# EasyEDA Pro project ax08.eprj, schematic ax08 lite, sheets 15 to 17 of 17

## Sheets
15 logic unit: Create Date: 2025-07-18; Page Name: logic unit; Update Date: 2025-08-11
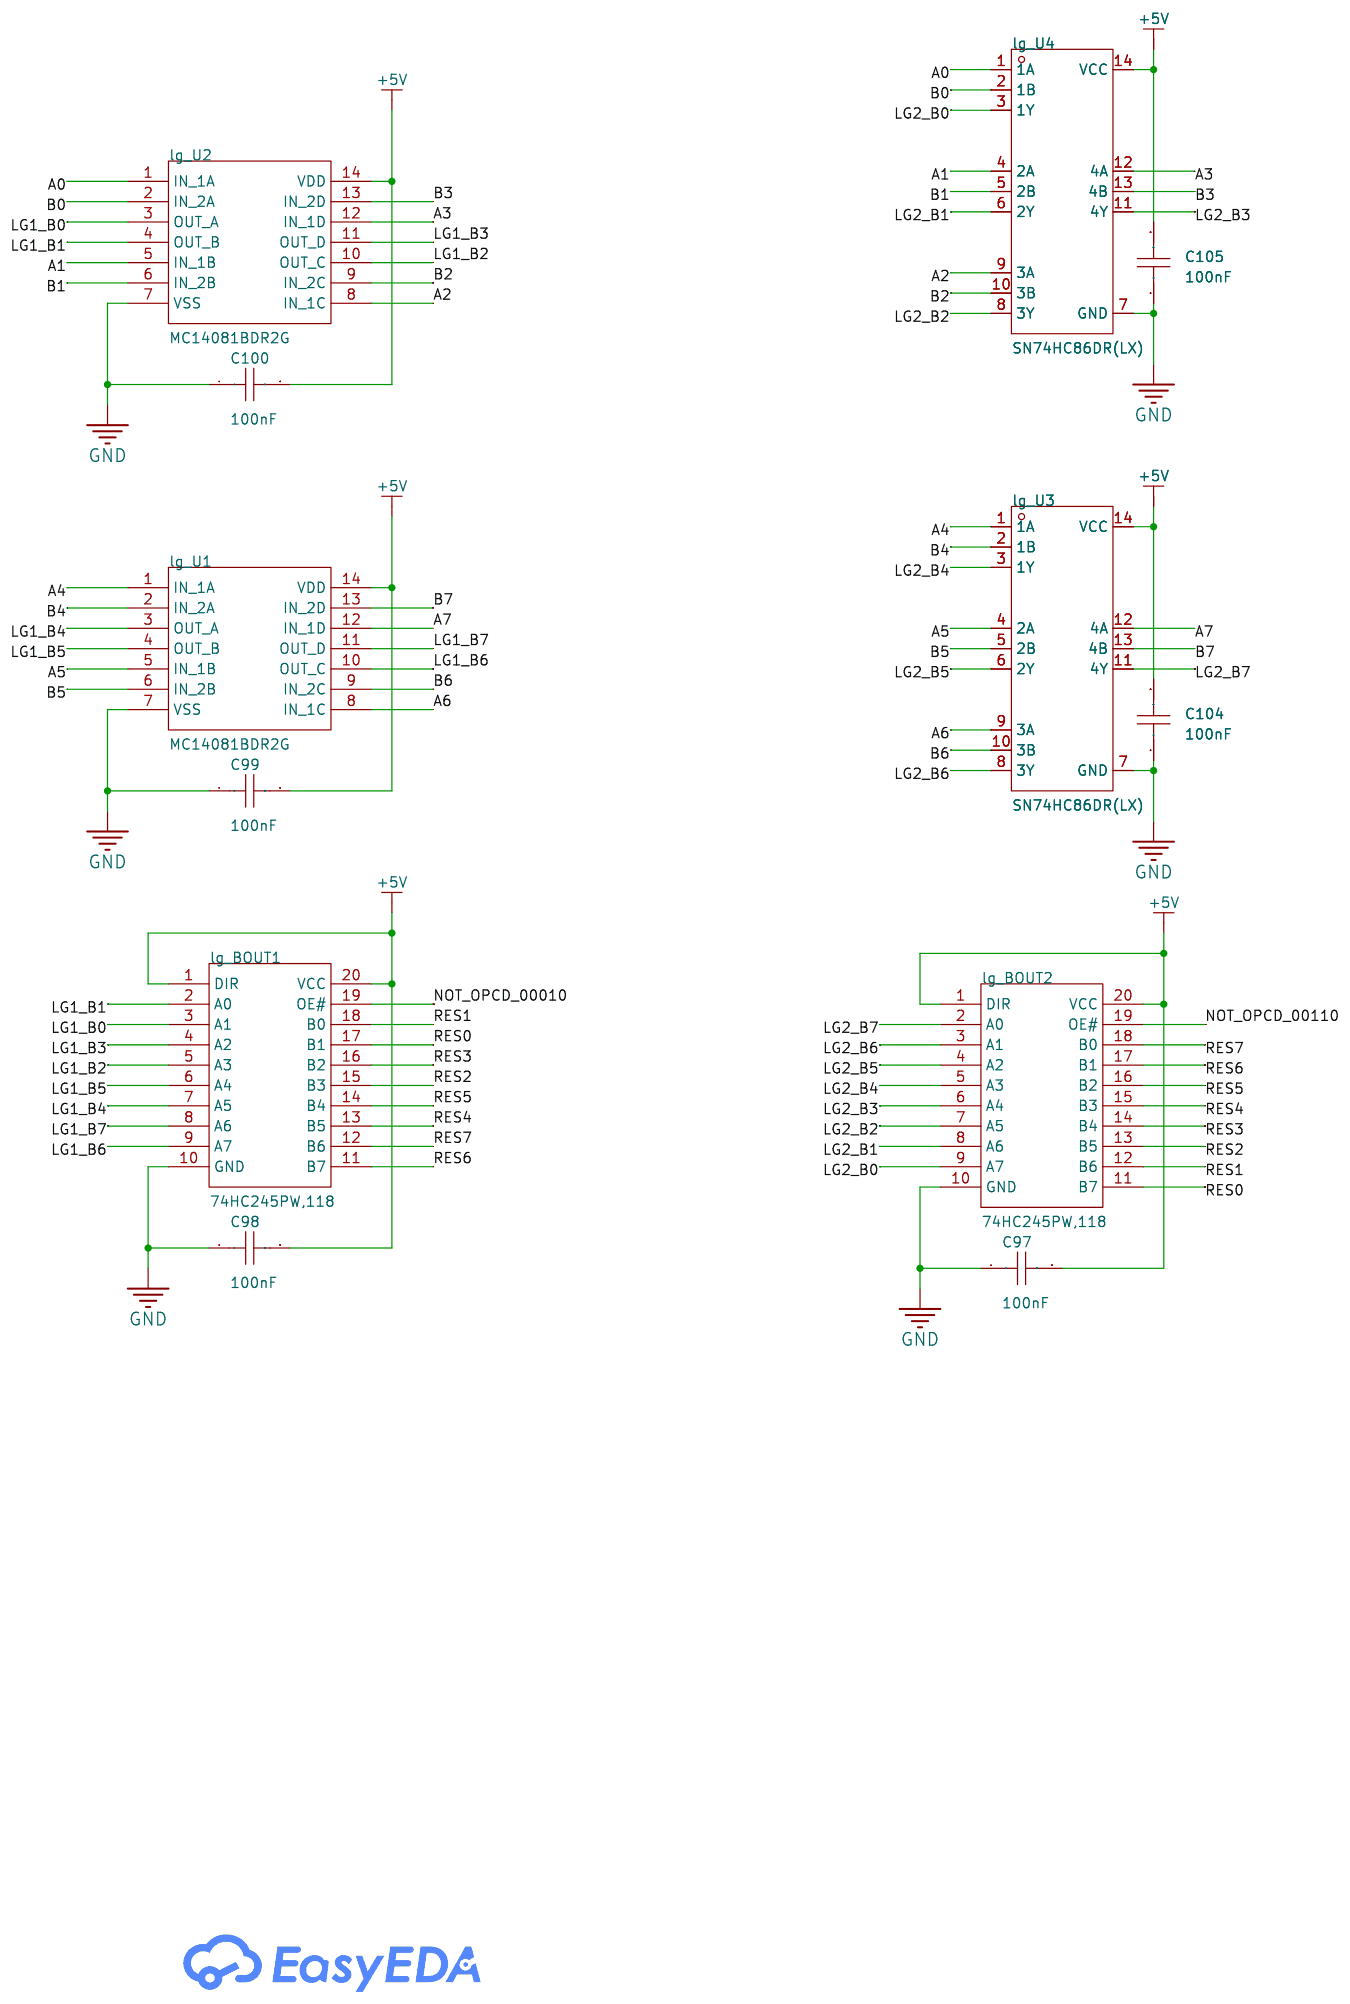
[diagram p16: logic unit]
16 power: Create Date: 2025-07-18; Page Name: power; Update Date: 2025-08-05
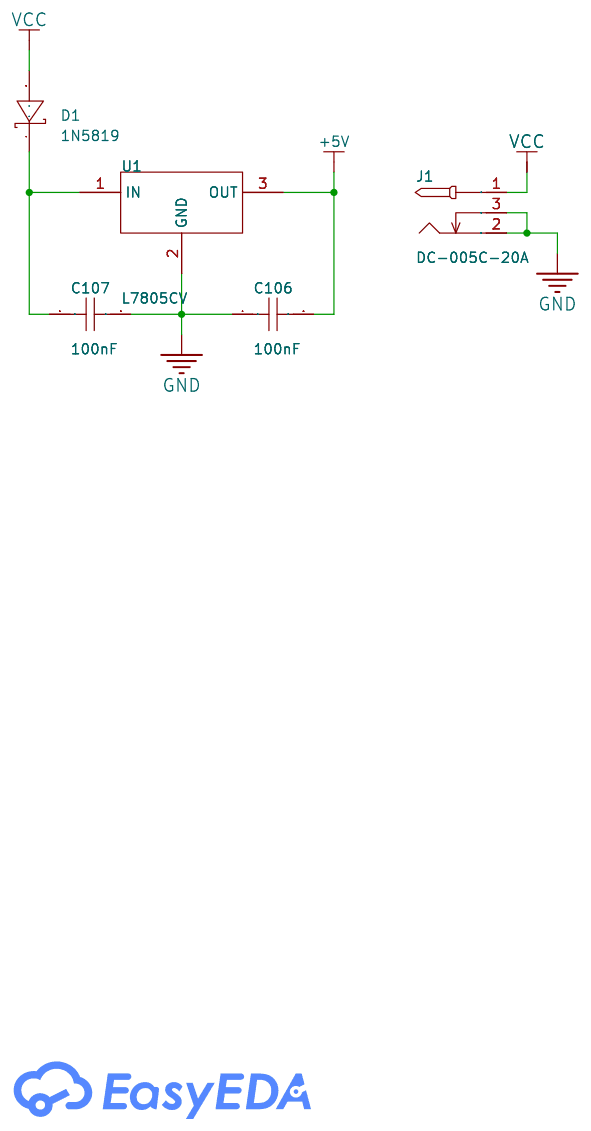
[diagram p17: power]
17 debug utils: Create Date: 2025-07-18; Page Name: debug utils; Update Date: 2025-08-12
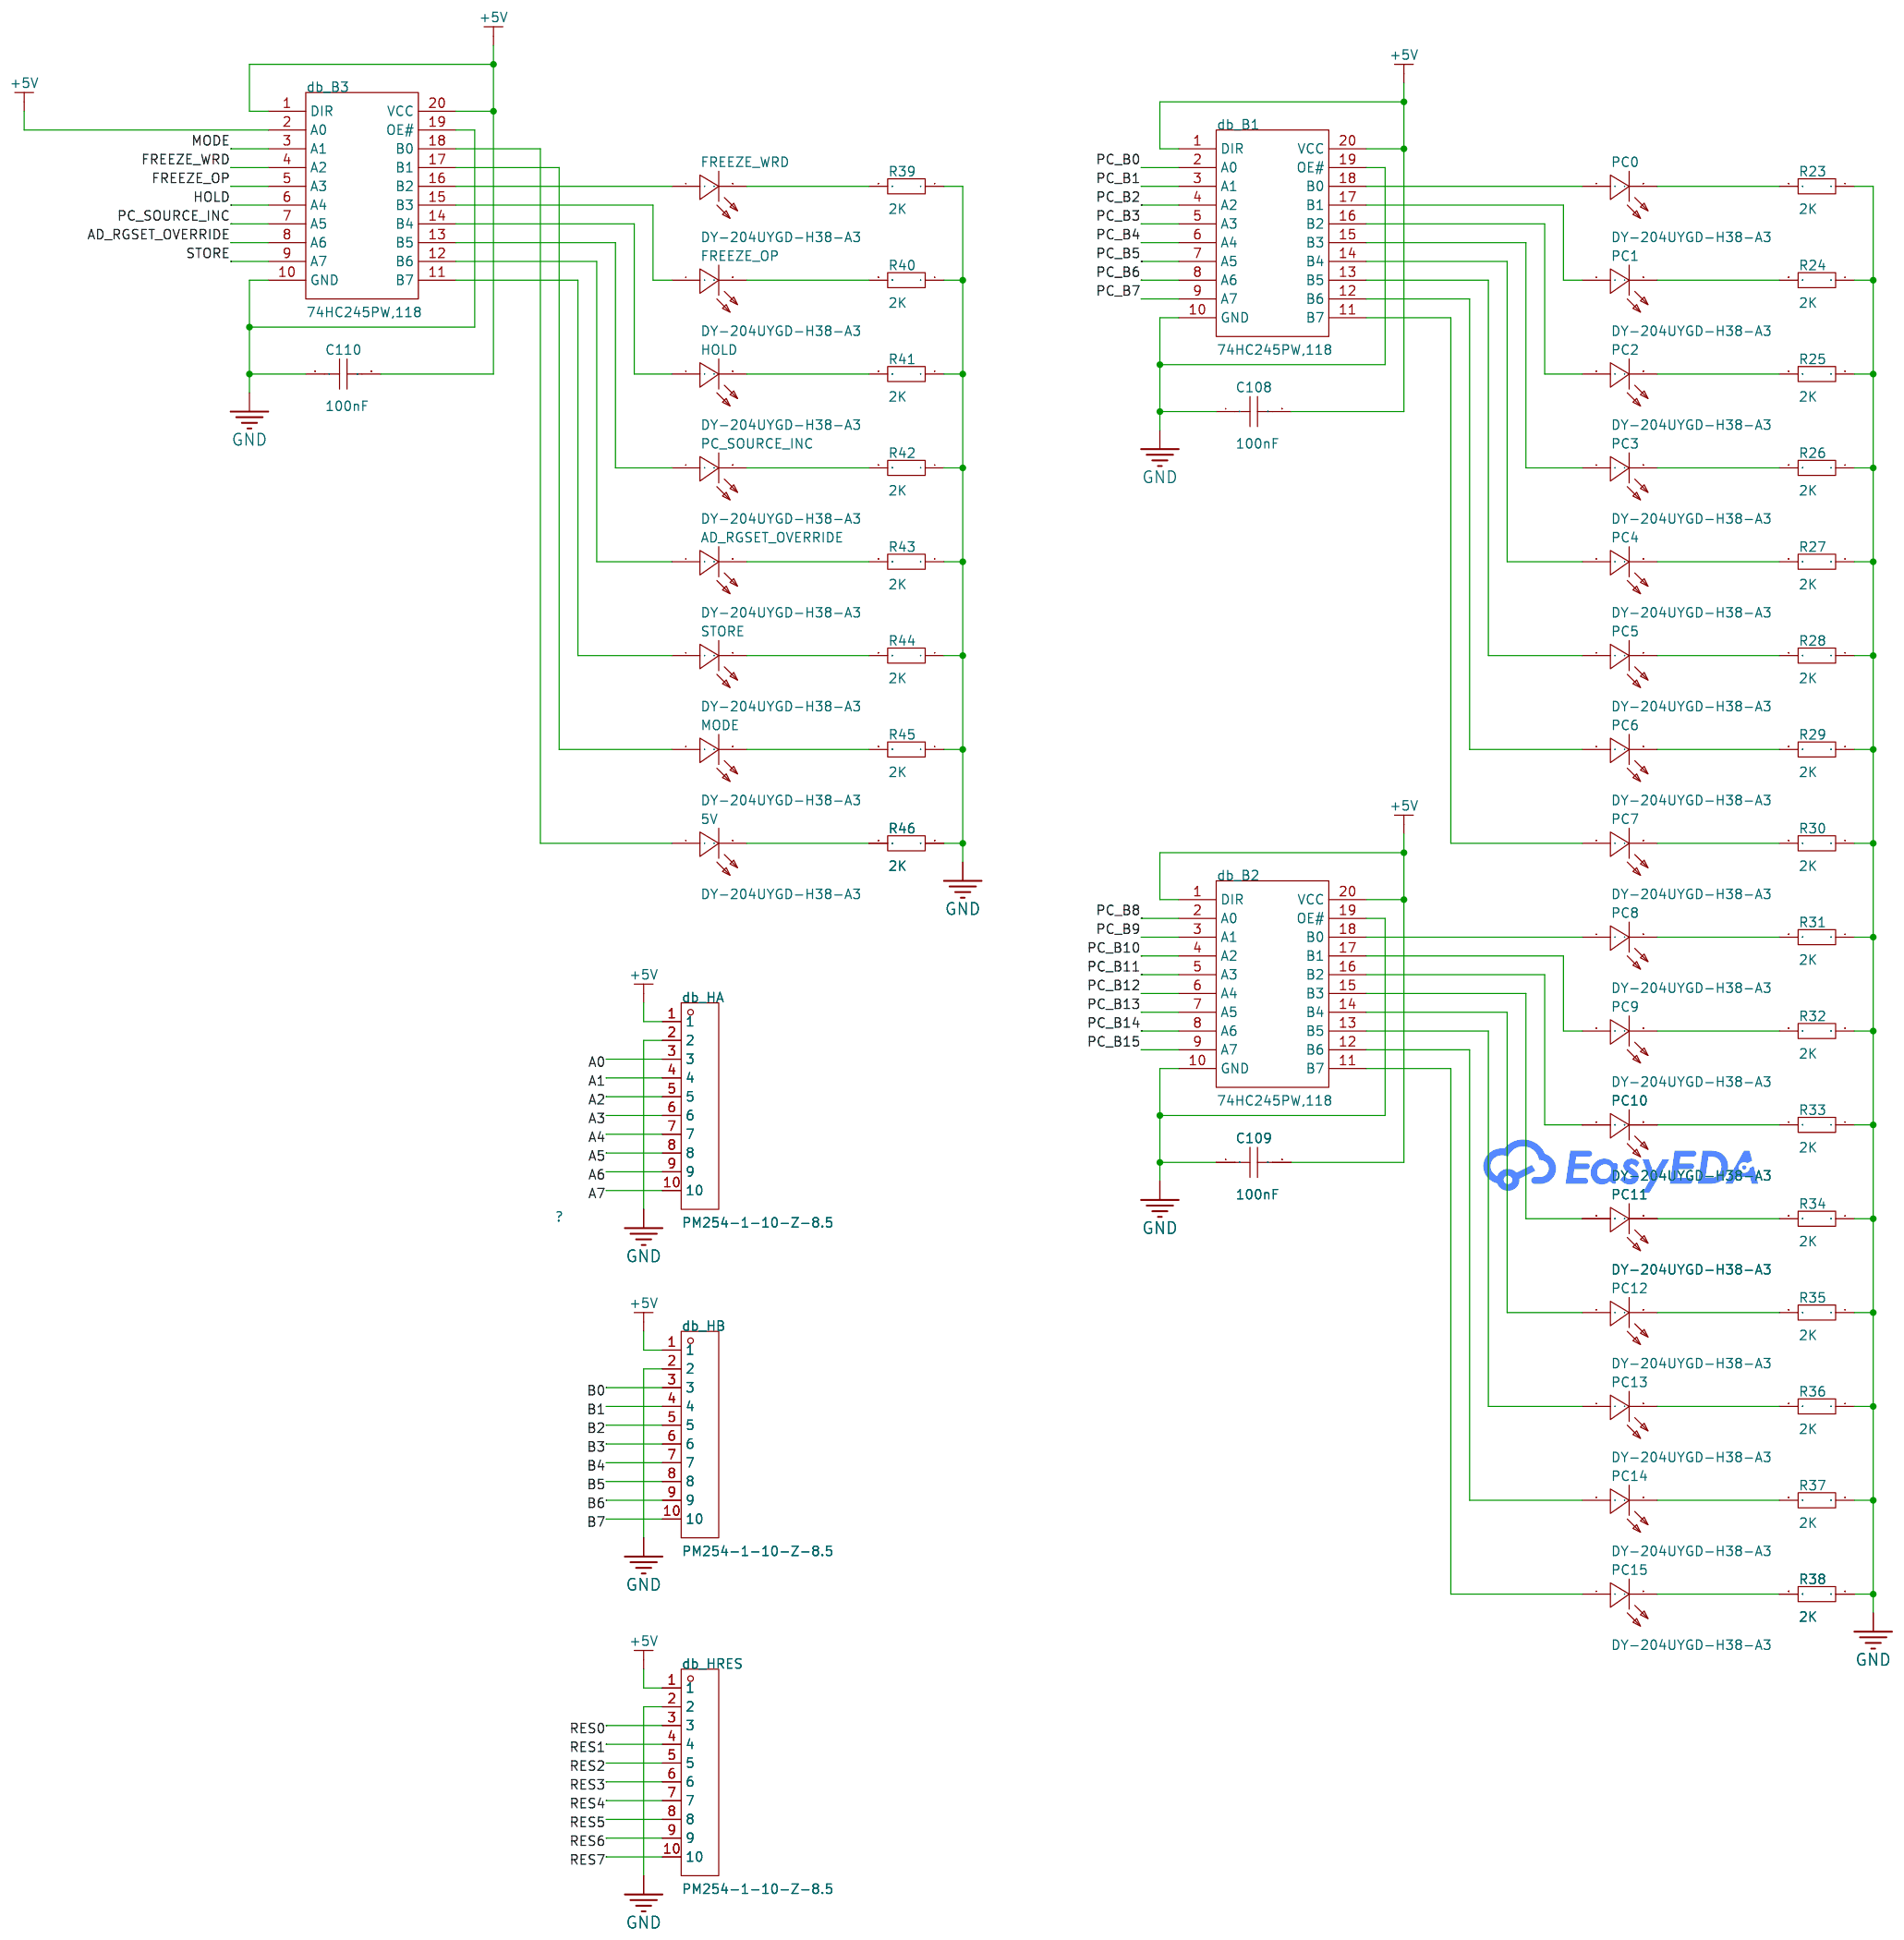
[diagram p18: debug utils]

## Parts
sheet debug utils
5V  DY-204UYGD-H38-A3  [LED-TH_BD4.0-P2.54-FD]
AD_RGSET_OVERRIDE  DY-204UYGD-H38-A3  [LED-TH_BD4.0-P2.54-FD]
C108  100nF  [C0805]
C109  100nF  [C0805]
C110  100nF  [C0805]
db_B1  74HC245PW,118  [TSSOP-20_L6.5-W4.4-P0.65-LS6.4-BL]
db_B2  74HC245PW,118  [TSSOP-20_L6.5-W4.4-P0.65-LS6.4-BL]
db_B3  74HC245PW,118  [TSSOP-20_L6.5-W4.4-P0.65-LS6.4-BL]
db_HA  PM254-1-10-Z-8.5  [HDR-TH_10P-P2.54-V-F]
db_HB  PM254-1-10-Z-8.5  [HDR-TH_10P-P2.54-V-F]
db_HRES  PM254-1-10-Z-8.5  [HDR-TH_10P-P2.54-V-F]
FREEZE_OP  DY-204UYGD-H38-A3  [LED-TH_BD4.0-P2.54-FD]
FREEZE_WRD  DY-204UYGD-H38-A3  [LED-TH_BD4.0-P2.54-FD]
HOLD  DY-204UYGD-H38-A3  [LED-TH_BD4.0-P2.54-FD]
MODE  DY-204UYGD-H38-A3  [LED-TH_BD4.0-P2.54-FD]
PC0  DY-204UYGD-H38-A3  [LED-TH_BD4.0-P2.54-FD]
PC1  DY-204UYGD-H38-A3  [LED-TH_BD4.0-P2.54-FD]
PC2  DY-204UYGD-H38-A3  [LED-TH_BD4.0-P2.54-FD]
PC3  DY-204UYGD-H38-A3  [LED-TH_BD4.0-P2.54-FD]
PC4  DY-204UYGD-H38-A3  [LED-TH_BD4.0-P2.54-FD]
PC5  DY-204UYGD-H38-A3  [LED-TH_BD4.0-P2.54-FD]
PC6  DY-204UYGD-H38-A3  [LED-TH_BD4.0-P2.54-FD]
PC7  DY-204UYGD-H38-A3  [LED-TH_BD4.0-P2.54-FD]
PC8  DY-204UYGD-H38-A3  [LED-TH_BD4.0-P2.54-FD]
PC9  DY-204UYGD-H38-A3  [LED-TH_BD4.0-P2.54-FD]
PC10  DY-204UYGD-H38-A3  [LED-TH_BD4.0-P2.54-FD]
PC11  DY-204UYGD-H38-A3  [LED-TH_BD4.0-P2.54-FD]
PC12  DY-204UYGD-H38-A3  [LED-TH_BD4.0-P2.54-FD]
PC13  DY-204UYGD-H38-A3  [LED-TH_BD4.0-P2.54-FD]
PC14  DY-204UYGD-H38-A3  [LED-TH_BD4.0-P2.54-FD]
PC15  DY-204UYGD-H38-A3  [LED-TH_BD4.0-P2.54-FD]
PC_SOURCE_INC  DY-204UYGD-H38-A3  [LED-TH_BD4.0-P2.54-FD]
R23  2K  [R0805_1]
R24  2K  [R0805_1]
R25  2K  [R0805_1]
R26  2K  [R0805_1]
R27  2K  [R0805_1]
R28  2K  [R0805_1]
R29  2K  [R0805_1]
R30  2K  [R0805_1]
R31  2K  [R0805_1]
R32  2K  [R0805_1]
R33  2K  [R0805_1]
R34  2K  [R0805_1]
R35  2K  [R0805_1]
R36  2K  [R0805_1]
R37  2K  [R0805_1]
R38  2K  [R0805_1]
R39  2K  [R0805_1]
R40  2K  [R0805_1]
R41  2K  [R0805_1]
R42  2K  [R0805_1]
R43  2K  [R0805_1]
R44  2K  [R0805_1]
R45  2K  [R0805_1]
R46  2K  [R0805_1]
STORE  DY-204UYGD-H38-A3  [LED-TH_BD4.0-P2.54-FD]
sheet logic unit
C97  100nF  [C0805]
C98  100nF  [C0805]
C99  100nF  [C0805]
C100  100nF  [C0805]
C104  100nF  [C0805]
C105  100nF  [C0805]
lg_BOUT1  74HC245PW,118  [TSSOP-20_L6.5-W4.4-P0.65-LS6.4-BL]
lg_BOUT2  74HC245PW,118  [TSSOP-20_L6.5-W4.4-P0.65-LS6.4-BL]
lg_U1  MC14081BDR2G  [SOIC-14_L8.7-W3.9-P1.27-LS6.0-BL]
lg_U2  MC14081BDR2G  [SOIC-14_L8.7-W3.9-P1.27-LS6.0-BL]
lg_U3  SN74HC86DR(LX)  [SOP-14_L8.5-W3.8-P1.27-LS6.2-BL]
lg_U4  SN74HC86DR(LX)  [SOP-14_L8.5-W3.8-P1.27-LS6.2-BL]
sheet power
C106  100nF  [C0805]
C107  100nF  [C0805]
D1  1N5819  [DO-41_BD2.4-L4.7-P8.70-D0.9-RD]
J1  DC-005C-20A  [DC-IN-TH_DC-005C-20A]
U1  L7805CV  [TO-220-3_L10.0-W4.5-P2.54-L]

## Library data of the parts
5V AD_RGSET_OVERRIDE FREEZE_OP FREEZE_WRD HOLD MODE PC0-PC15 PC_SOURCE_INC STORE = DY-204UYGD-H38-A3: LCSC Part Name: 3mm圆头有边黄绿色; Supplier Part: C7470727; Manufacturer: TONYU(东裕); Supplier Footprint: D=3mm; JLCPCB Part Class: Extended Part; Datasheet: https://atta.szlcsc.com/upload/public/pdf/source/20230726/000EB079CD0A8C169FA94F7B667CD1E2.pdf; Supplier: LCSC
C97-C100 C104-C110 = CC0805KRX7R9BB104: Capacitance: Tolerance:±10% Tolerance:±10% Voltage Rated: Temperature Coefficient:; LCSC Part Name: 100nF ±10% 50V; Supplier Part: C49678; Manufacturer: YAGEO(国巨); Supplier Footprint: 0805; JLCPCB Part Class: Basic Part; Datasheet: https://atta.szlcsc.com/upload/public/pdf/source/20180224/C181747_15194369449651363981.pdf; Supplier: LCSC; Tolerance: ±10%
db_B1-db_B3 lg_BOUT1 lg_BOUT2 = 74HC245PW,118: Input type:- output type:Tri-State Supply Voltage:2V~6V Supply Voltage:2V~6V Number of Elements:1 Number of Bits per Element:8 Channel Type:- Sink Current:7.8mA Source Current:7.8mA Logic Family:74HC Operating Temperature:-40℃~+125℃ Operating Temperature:; Supplier Part: C5626; Manufacturer: Nexperia(安世); Supplier Footprint: TSSOP-20; JLCPCB Part Class: Extended Part; Datasheet: https://atta.szlcsc.com/upload/public/pdf/source/20240724/EDC8C45902BA97AEC59E8811E3964917.pdf; Supplier: LCSC; output type: Tri-State; Supply Voltage: 2V~6V; Number of Elements: 1; Number of Bits per Element: 8; Sink Current: 7.8mA; Source Current: 7.8mA; Logic Family: 74HC; Operating Temperature: -40℃~+125℃
db_HA db_HB db_HRES = PM254-1-10-Z-8.5: Holes Structure:1x10P Pitch:2.54mm Row Spacing:- Circular Hole / Square Hole:Square Holes Mounting Type:Straight Number of Rows:Plugin Number of Holes:10P Current Rating (Max):3A Voltage Rating (Max):- Holes Direction:Top Insulation Height:8.5mm Contact M; LCSC Part Name: 1x10P 间距:2.54mm 直插; Supplier Part: C2897373; Manufacturer: HCTL(华灿天禄); Supplier Footprint: 插件,P=2.54mm; JLCPCB Part Class: Extended Part; Datasheet: https://atta.szlcsc.com/upload/public/pdf/source/20230609/534BE42964C679BDE98E061007C4ABD6.pdf; Supplier: LCSC; Holes Structure: 1x10P; Pitch: 2.54mm; Circular Hole / Square Hole: Square Holes; Mounting Type: Straight; Number of Rows: Plugin; Number of Holes: 10P; Current Rating (Max): 3A; Holes Direction: Top; Insulation Height: 8.5mm; Contact Material: Copper Alloy; Operating Temperature Range: -40℃~+105℃; Soldering Temperature(Max): 260℃@5S
R23-R46 = Res_0603: Supplier Footprint: 0603
lg_U1 lg_U2 = MC14081BDR2G: Supplier Part: C52342; Manufacturer: onsemi(安森美); Supplier Footprint: SOIC-14; JLCPCB Part Class: Extended Part; Datasheet: https://atta.szlcsc.com/upload/public/pdf/source/20191203/C463300_6D19168778DBD465A86B239F140F6B23.pdf; Supplier: LCSC; Logic Gate Type: With Door; Number of Channels: 4; Supply Voltage: 3V~18V; Quiescent Current (Max): 1uA; Sink Current: 8.8mA; Source Current: 8.8mA; High Level Range (VIH): 3.5V~11V; Low Level Range (VIL): 1.5V~4V; Series: 4000BSeries; Propagation Delay Time: 100ns@15V,50pF; Operating Temperature: -55℃~+125℃
lg_U3 lg_U4 = SN74HC86DR(LX): LCSC Part Name: 集成电路; Supplier Part: C22436997; Manufacturer: LX(灵星芯微); Supplier Footprint: SOP-14; JLCPCB Part Class: Extended Part; Datasheet: https://atta.szlcsc.com/upload/public/pdf/source/20240524/675B1C928075FFB7AC00BEC82378813F.pdf; Supplier: LCSC; Logic Gate Type: XORGate; Number of Channels: 4; Supply Voltage: 2V~6V; Quiescent Current (Max): 2uA; High Level Range (VIH): 1.5V~4.2V; Low Level Range (VIL): 500mV~1.8V; Series: 74HCSeries; Propagation Delay Time: 20ns@6V,50pF; Operating Temperature: -40℃~+125℃
D1 = 1N5819_C237257: LCSC Part Name: 电压:40V 电流:1A; Supplier Part: C237257; Manufacturer: HL(豪林); Supplier Footprint: DO-41; JLCPCB Part Class: Extended Part; Supplier: LCSC; Forward Voltage (Vf@If): 600mV@1A; Reverse Voltage (Vr): 40V; Average Rectified Current (Io): 1A
J1 = DC-005C-20A: LCSC Part Name: DC电源插座 内径:2mm 外径:6.4mm; Supplier Part: C84007; Manufacturer: 韩国韩荣; Supplier Footprint: 插件; JLCPCB Part Class: Extended Part; Datasheet: https://atta.szlcsc.com/upload/public/pdf/source/20210810/A9F07BBB960FE584CB8DE17AFB8953D7.pdf; Supplier: LCSC; Connector Type: DC Power Receptacle; Mounting Style: Bend insert; Inside Contact Diameter: 2mm; Outside Contact Diameter: 6.4mm; Current Rating (Max): 3A; Voltage Rating (Max): 24V; Operating Temperature Range: -20℃~+70℃
U1 = L7805CV_C111887: LCSC Part Name: 正稳压器IC; Supplier Part: C111887; Manufacturer: ST(意法半导体); Supplier Footprint: TO-220; JLCPCB Part Class: Extended Part; Datasheet: https://atta.szlcsc.com/upload/public/pdf/source/20180606/C192854_20B6D8F8F52B6FFCE5644906251095FD.pdf; Supplier: LCSC; Output Type: Fixed; Maximum Input Voltage: 35V; Output Voltage: 5V; Output Current: 1.5A; Power Supply Rejection Ratio (PSRR): 62dB@(120Hz); Dropout Voltage: 2V@(1A); standby current: 8mA; Feature: Short-Circuit  Protection；Thermal Protection(TSD)；Overcurrent Protection(OCP); Operating Temperature: 0℃~+125℃; Output Polarity: Positive electrode; Number of Outputs: 1

## Nets
+5V: C97.2 C98.2 C99.2 C100.2 C104.2 C105.2 C106.2 C108.2 C109.2 C110.2 db_B1.1(DIR) db_B1.20(VCC) db_B2.1(DIR) db_B2.20(VCC) db_B3.1(DIR) db_B3.2(A0) db_B3.20(VCC) db_HA.1 db_HB.1 db_HRES.1 lg_BOUT1.1(DIR) lg_BOUT1.20(VCC) lg_BOUT2.1(DIR) lg_BOUT2.20(VCC) lg_U1.14(VDD) lg_U2.14(VDD) lg_U3.14(VCC) lg_U4.14(VCC) U1.3(OUT) ; also on sheet 1 2 3 4 5 6 7 8 9 10 11 12 13 14
GND: C97.1 C98.1 C99.1 C100.1 C104.1 C105.1 C106.1 C107.2 C108.1 C109.1 C110.1 db_B1.10(GND) db_B1.19(OE#) db_B2.10(GND) db_B2.19(OE#) db_B3.10(GND) db_B3.19(OE#) db_HA.2 db_HB.2 db_HRES.2 J1.2 J1.3 lg_BOUT1.10(GND) lg_BOUT2.10(GND) lg_U1.7(VSS) lg_U2.7(VSS) lg_U3.7(GND) lg_U4.7(GND) R23.1 R24.1 R25.1 R26.1 R27.1 R28.1 R29.1 R30.1 R31.1 R32.1 R33.1 R34.1 R35.1 R36.1 R37.1 R38.1 R39.1 R40.1 R41.1 R42.1 R43.1 R44.1 R45.1 R46.1 U1.2(GND) ; also on sheet 1 2 3 4 5 6 7 8 9 10 11 12 13 14
VCC: D1.2(A) J1.1 ; also on sheet 5
A0: db_HA.3 lg_U2.1(IN 1A) lg_U4.1(1A) ; also on sheet 1 2 4 5 10 11 12 13 14
A1: db_HA.4 lg_U2.5(IN 1B) lg_U4.4(2A) ; also on sheet 1 2 4 5 10 11 12 13 14
A2: db_HA.5 lg_U2.8(IN 1C) lg_U4.9(3A) ; also on sheet 1 2 4 5 10 11 12 13 14
A3: db_HA.6 lg_U2.12(IN 1D) lg_U4.12(4A) ; also on sheet 1 2 4 5 10 11 12 13 14
A4: db_HA.7 lg_U1.1(IN 1A) lg_U3.1(1A) ; also on sheet 1 2 4 5 10 11 13 14
A5: db_HA.8 lg_U1.5(IN 1B) lg_U3.4(2A) ; also on sheet 1 2 4 5 10 11 13 14
A6: db_HA.9 lg_U1.8(IN 1C) lg_U3.9(3A) ; also on sheet 1 2 4 5 10 11 13 14
A7: db_HA.10 lg_U1.12(IN 1D) lg_U3.12(4A) ; also on sheet 1 2 4 5 10 11 13 14
AD_RGSET_OVERRIDE: db_B3.8(A6) ; also on sheet 8 9
B0: db_HB.3 lg_U2.2(IN 2A) lg_U4.2(1B) ; also on sheet 1 2 4 5 11 14
B1: db_HB.4 lg_U2.6(IN 2B) lg_U4.5(2B) ; also on sheet 1 2 4 5 11 14
B2: db_HB.5 lg_U2.9(IN 2C) lg_U4.10(3B) ; also on sheet 1 2 4 5 11 14
B3: db_HB.6 lg_U2.13(IN 2D) lg_U4.13(4B) ; also on sheet 1 2 4 5 11 14
B4: db_HB.7 lg_U1.2(IN 2A) lg_U3.2(1B) ; also on sheet 1 2 4 5 11 14
B5: db_HB.8 lg_U1.6(IN 2B) lg_U3.5(2B) ; also on sheet 1 2 4 5 11 14
B6: db_HB.9 lg_U1.9(IN 2C) lg_U3.10(3B) ; also on sheet 1 2 4 5 11 14
B7: db_HB.10 lg_U1.13(IN 2D) lg_U3.13(4B) ; also on sheet 1 2 4 5 11 14
FREEZE_OP: db_B3.5(A3) ; also on sheet 5 8
FREEZE_WRD: db_B3.4(A2) ; also on sheet 2 5 8
HOLD: db_B3.6(A4) ; also on sheet 5 6 8 10
LG1_B0: lg_BOUT1.3(A1) lg_U2.3(OUT A)
LG1_B1: lg_BOUT1.2(A0) lg_U2.4(OUT B)
LG1_B2: lg_BOUT1.5(A3) lg_U2.10(OUT C)
LG1_B3: lg_BOUT1.4(A2) lg_U2.11(OUT D)
LG1_B4: lg_BOUT1.7(A5) lg_U1.3(OUT A)
LG1_B5: lg_BOUT1.6(A4) lg_U1.4(OUT B)
LG1_B6: lg_BOUT1.9(A7) lg_U1.10(OUT C)
LG1_B7: lg_BOUT1.8(A6) lg_U1.11(OUT D)
LG2_B0: lg_BOUT2.9(A7) lg_U4.3(1Y)
LG2_B1: lg_BOUT2.8(A6) lg_U4.6(2Y)
LG2_B2: lg_BOUT2.7(A5) lg_U4.8(3Y)
LG2_B3: lg_BOUT2.6(A4) lg_U4.11(4Y)
LG2_B4: lg_BOUT2.5(A3) lg_U3.3(1Y)
LG2_B5: lg_BOUT2.4(A2) lg_U3.6(2Y)
LG2_B6: lg_BOUT2.3(A1) lg_U3.8(3Y)
LG2_B7: lg_BOUT2.2(A0) lg_U3.11(4Y)
MODE: db_B3.3(A1) ; also on sheet 2 7 8
NOT_OPCD_00010: lg_BOUT1.19(OE#) ; also on sheet 9
NOT_OPCD_00110: lg_BOUT2.19(OE#) ; also on sheet 9
PC_B0: db_B1.2(A0) ; also on sheet 2 5
PC_B1: db_B1.3(A1) ; also on sheet 2 5
PC_B2: db_B1.4(A2) ; also on sheet 2 5
PC_B3: db_B1.5(A3) ; also on sheet 2 5
PC_B4: db_B1.6(A4) ; also on sheet 2 5
PC_B5: db_B1.7(A5) ; also on sheet 2 5
PC_B6: db_B1.8(A6) ; also on sheet 2 5
PC_B7: db_B1.9(A7) ; also on sheet 2 5
PC_B8: db_B2.2(A0) ; also on sheet 2 5
PC_B9: db_B2.3(A1) ; also on sheet 2 5
PC_B10: db_B2.4(A2) ; also on sheet 2 5
PC_B11: db_B2.5(A3) ; also on sheet 2 5
PC_B12: db_B2.6(A4) ; also on sheet 2 5
PC_B13: db_B2.7(A5) ; also on sheet 2 5
PC_B14: db_B2.8(A6) ; also on sheet 2 5
PC_B15: db_B2.9(A7) ; also on sheet 2 5
PC_SOURCE_INC: db_B3.7(A5) ; also on sheet 2 8
RES0: db_HRES.3 lg_BOUT1.17(B1) lg_BOUT2.11(B7) ; also on sheet 5 6 10 11 12 13 14
RES1: db_HRES.4 lg_BOUT1.18(B0) lg_BOUT2.12(B6) ; also on sheet 5 6 10 11 12 13 14
RES2: db_HRES.5 lg_BOUT1.15(B3) lg_BOUT2.13(B5) ; also on sheet 5 6 10 11 12 13 14
RES3: db_HRES.6 lg_BOUT1.16(B2) lg_BOUT2.14(B4) ; also on sheet 5 6 10 11 12 13 14
RES4: db_HRES.7 lg_BOUT1.13(B5) lg_BOUT2.15(B3) ; also on sheet 5 6 10 11 12 13 14
RES5: db_HRES.8 lg_BOUT1.14(B4) lg_BOUT2.16(B2) ; also on sheet 5 6 10 11 12 13 14
RES6: db_HRES.9 lg_BOUT1.11(B7) lg_BOUT2.17(B1) ; also on sheet 5 6 10 11 12 13 14
RES7: db_HRES.10 lg_BOUT1.12(B6) lg_BOUT2.18(B0) ; also on sheet 5 6 10 11 12 13 14
STORE: db_B3.9(A7) ; also on sheet 8 9
$19N471: C107.1 D1.1(K) U1.1(IN)
$20N946: PC0.2(K) R23.2
$20N972: PC1.2(K) R24.2
$20N998: PC2.2(K) R25.2
$20N1024: PC3.2(K) R26.2
$20N1050: PC4.2(K) R27.2
$20N1076: PC5.2(K) R28.2
$20N1102: PC6.2(K) R29.2
$20N1128: PC7.2(K) R30.2
$20N1154: PC8.2(K) R31.2
$20N1180: PC9.2(K) R32.2
$20N1206: PC10.2(K) R33.2
$20N1232: PC11.2(K) R34.2
$20N1258: PC12.2(K) R35.2
$20N1284: PC13.2(K) R36.2
$20N1310: PC14.2(K) R37.2
$20N1336: PC15.2(K) R38.2
$20N2149: db_B1.18(B0) PC0.1(A)
$20N2153: db_B1.17(B1) PC1.1(A)
$20N2159: db_B1.16(B2) PC2.1(A)
$20N2165: db_B1.15(B3) PC3.1(A)
$20N2171: db_B1.14(B4) PC4.1(A)
$20N2177: db_B1.13(B5) PC5.1(A)
$20N2183: db_B1.12(B6) PC6.1(A)
$20N2191: db_B1.11(B7) PC7.1(A)
$20N2195: db_B2.15(B3) PC11.1(A)
$20N2199: db_B2.17(B1) PC9.1(A)
$20N2203: db_B2.16(B2) PC10.1(A)
$20N2207: db_B2.13(B5) PC13.1(A)
$20N2211: db_B2.14(B4) PC12.1(A)
$20N2215: db_B2.12(B6) PC14.1(A)
$20N2219: db_B2.11(B7) PC15.1(A)
$20N2223: db_B2.18(B0) PC8.1(A)
$20N3734: PC_SOURCE_INC.2(K) R42.2
$20N3735: AD_RGSET_OVERRIDE.2(K) R43.2
$20N3736: R44.2 STORE.2(K)
$20N3737: MODE.2(K) R45.2
$20N3738: FREEZE_OP.2(K) R40.2
$20N3739: FREEZE_WRD.2(K) R39.2
$20N3740: HOLD.2(K) R41.2
$20N3742: 5V.2(K) R46.2
$20N3743: 5V.1(A) db_B3.18(B0)
$20N3744: db_B3.11(B7) STORE.1(A)
$20N3745: AD_RGSET_OVERRIDE.1(A) db_B3.12(B6)
$20N3746: db_B3.13(B5) PC_SOURCE_INC.1(A)
$20N3747: db_B3.17(B1) MODE.1(A)
$20N3748: db_B3.14(B4) HOLD.1(A)
$20N3749: db_B3.15(B3) FREEZE_OP.1(A)
$20N3922: db_B3.16(B2) FREEZE_WRD.1(A)
